# EasyEDA Pro project can-mcu.eprj, board main-board
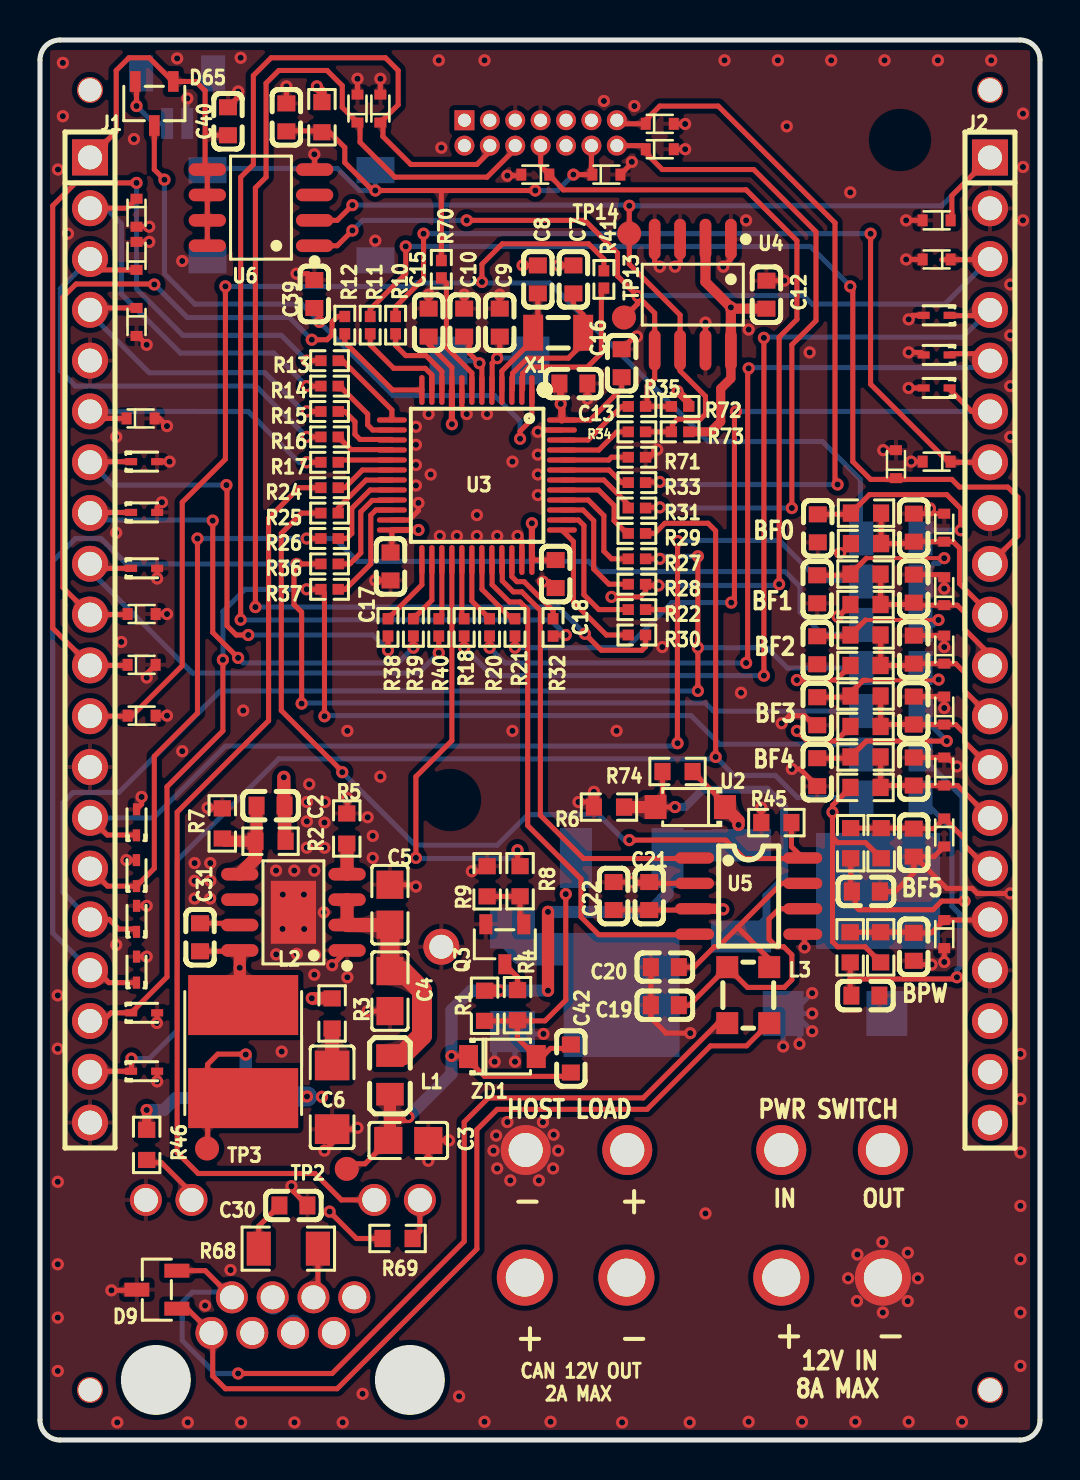
[diagram p7: board, top side]
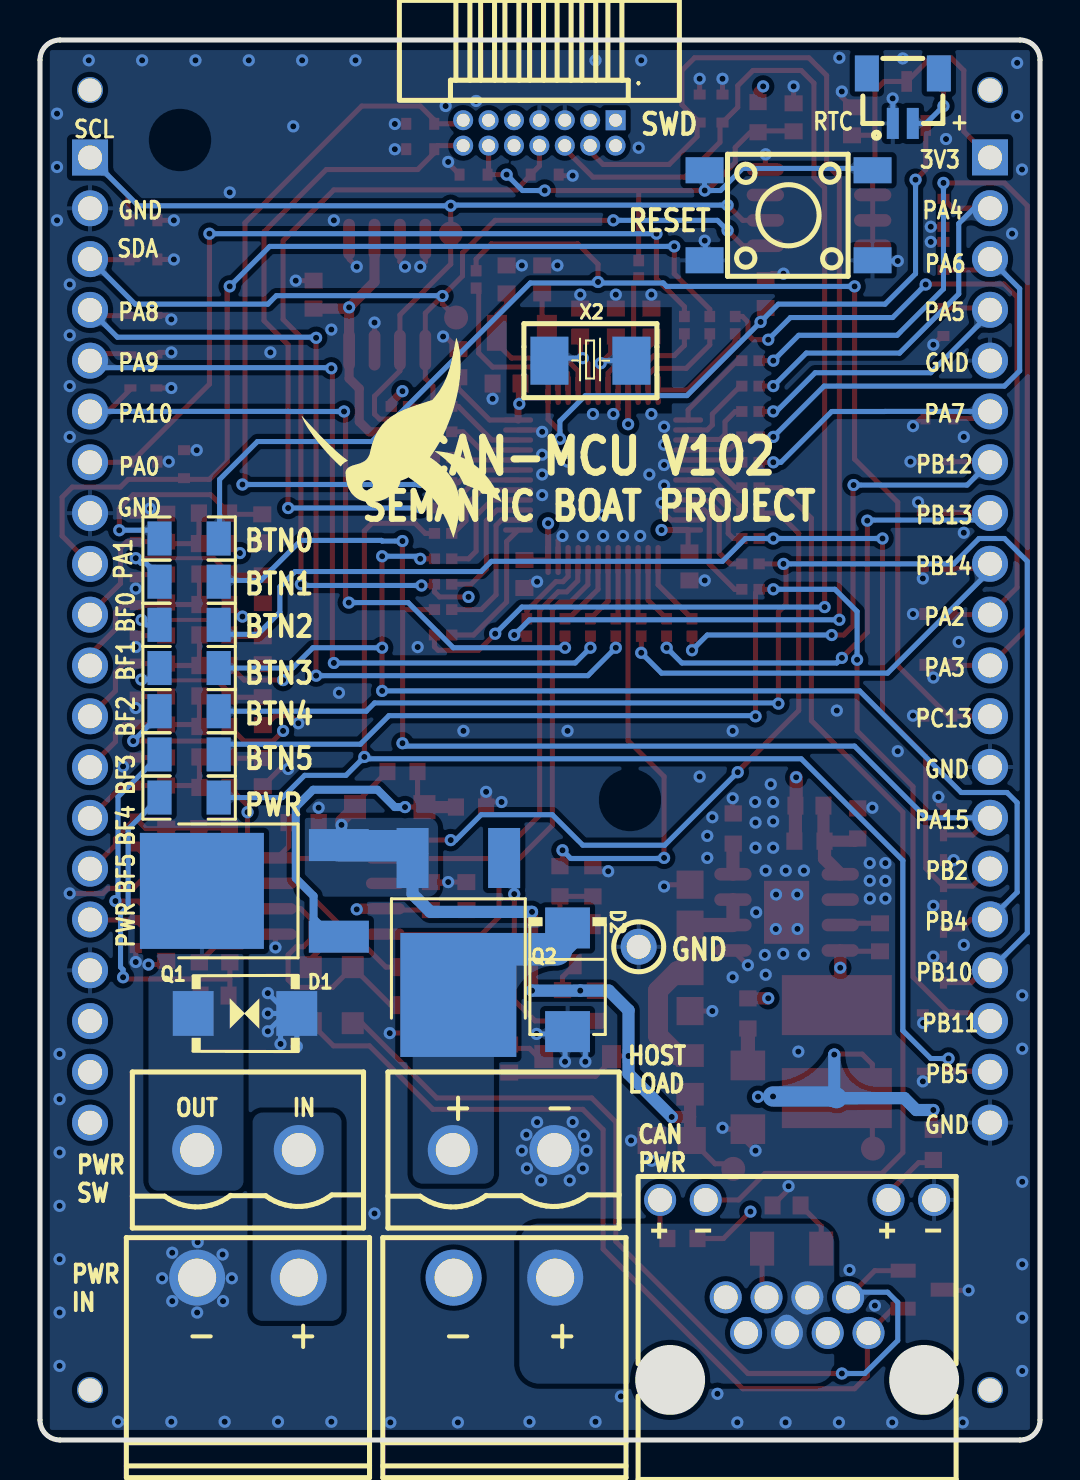
[diagram p8: board, bottom side, seen from below]

Outline 50 x 70 mm; copper layers: Top Layer, Inner1, Inner2, Bottom Layer. Coordinates in mm from the lower left corner of the outline.
Outline path: 0,69 0,1 arc(0.29,0.29) 1,0 49,0 arc(49.71,0.29) 50,1 50,69 arc(49.71,69.71) 49,70 1,70 arc(0.29,69.71) 0,69
Stack: Top Layer 0.035mm Outer layer thickness 1oz / Dielectric1 0.2104mm 7628 RC49% 8.6mil / Inner1 0.0152mm Inner layer thickness / Dielectric2 1.065mm 1.1mm H/HOZ Copper / Inner2 0.0152mm Inner layer thickness / Dielectric3 0.2104mm 7628 RC49% 8.6mil / Bottom Layer 0.035mm Outer layer thickness 1oz

## Design rules (mm)
template: JLCPCB Capability(Two Layers Board)
spacing copperThickness1oz (default): track to track 0.102, other pairs 0.152 to 0.3
spacing copperThickness2oz: track to track 0.203, other pairs 0.152 to 0.3
track width copperThickness1oz (default): min 0.127, default 0.254, max 2.54
track width copperThickness2oz: min 0.203, default 0.254, max 2.54
differential pair differentialPair (default): width min 0.127, default 0.254, max 2.54; gap min 0.152, default 0.152
via viaSize (default): diameter min 0.5, default 0.61, max 10; hole min 0.3, default 0.305, max 6.3

## Placement (name value [footprint] x y rotation side)
C2  100nF  [C0603]  11.53 31.72 0 top
C3  10uF  [C0805]  18.41 14.98 180 top
C4  2.2uF  [C0805]  17.5 22.45 90 top
C5  2.2uF  [C0805]  17.5 26.76 270 top
C6  47uF  [C1206]  14.6 17.14 90 top
C7  22pF  [C0603]  26.67 58.03 270 top
C8  22pF  [C0603]  24.89 58.03 270 top
C9  33pF  [C0603]  22.99 55.87 270 top
C10  33pF  [C0603]  21.21 55.87 270 top
C11  100nF  [C0603]  12.32 66.13 270 top
C12  100nF  [C0603]  36.32 57.27 270 top
C13  4.7uF  [C0603]  26.67 52.82 0 top
C15  100nF  [C0603]  19.43 55.87 90 top
C16  100nF  [C0603]  29.08 53.84 270 top
C17  100nF  [C0603]  17.53 43.68 270 top
C18  100nF  [C0603]  25.78 43.3 270 top
C19  47pF  [C0603]  31.24 21.74 180 top
C20  47pF  [C0603]  31.24 23.64 180 top
C21  4.7uF  [C0603]  30.46 27.2 90 top
C22  100nF  [C0603]  28.68 27.2 90 top
C23  100nF  [C0603]  38.89 45.58 90 top
C24  100nF  [C0603]  38.86 42.53 90 top
C25  100nF  [C0603]  38.86 39.49 90 top
C26  100nF  [C0603]  38.86 36.44 90 top
C27  100nF  [C0603]  38.86 33.39 90 top
C28  100nF  [C0603]  41.3 27.43 180 top
C29  100nF  [C0603]  41.27 22.22 180 top
C30  100nF  [C0603]  12.67 11.73 180 top
C31  2.2nF  [C0603]  8 25.14 270 top
C32  100nF  [C0603]  43.69 45.62 270 top
C33  100nF  [C0603]  43.69 42.57 270 top
C34  100nF  [C0603]  43.69 39.52 270 top
C35  100nF  [C0603]  43.69 36.47 270 top
C36  100nF  [C0603]  43.69 33.42 270 top
C37  100nF  [C0603]  43.69 29.87 90 top
C38  100nF  [C0603]  43.69 24.66 90 top
C39  100nF  [C0603]  13.72 57.3 90 top
C40  100nF  [C0603]  9.4 65.94 270 top
C42  1uF  [C0603]  26.54 19.07 270 top
CN1  DB2EVC-5.08-2P-GN  [CONN-TH_2P-P5.08_DB2EVC-5.08-2P]  39.6 14.5 0 bottom
CN2  DB2ERC-5.08-2P-GN  [CONN-TH_2P-P5.08_DB2ERC-5.08-2P]  39.6 8.12 180 bottom
CN3  DB2EVC-5.08-2P-GN  [CONN-TH_2P-P5.08_DB2EVC-5.08-2P]  26.82 14.5 0 bottom
CN5  DB2ERC-5.08-2P-GN  [CONN-TH_2P-P5.08_DB2ERC-5.08-2P]  26.78 8.12 180 bottom
CN6  BM02B-SRSS-TB(LF)(SN)  [CONN-TH_BM02B-SRSS-TB-LF-SN]  6.86 67.08 0 bottom
CN7  HX PZ1.27-2x7P WZ  [HDR-TH_14P-P1.27-H-M-R2-C7-S1.27-W7.5-N]  25.03 65.35 0 bottom
D1  SMBJ20CA  [SMB_L4.3-W3.6-LS5.4-BI]  39.75 21.33 180 bottom
D2  SS510B  [SMB_L4.6-W3.5-LS5.3-RD]  23.62 23.01 270 bottom
D3  ESD5Z3.3T1G  [SOD-523_L1.2-W0.8-LS1.6-FD]  30.99 65.81 180 top
D4  ESD5Z3.3T1G  [SOD-523_L1.2-W0.8-LS1.6-FD]  17.02 66.57 270 top
D5  ESD5Z3.3T1G  [SOD-523_L1.2-W0.8-LS1.6-FD]  15.88 66.57 270 top
D6  ESD5Z3.3T1G  [SOD-523_L1.2-W0.8-LS1.6-FD]  24.76 63.27 0 top
D7  ESD5Z3.3T1G  [SOD-523_L1.2-W0.8-LS1.6-FD]  28.32 63.27 180 top
D8  ESD5Z3.3T1G  [SOD-523_L1.2-W0.8-LS1.6-FD]  30.99 64.54 180 top
D9  PESD2CAN  [SOT-23-3_L2.9-W1.3-P1.90-LS2.4-BR#2]  5.84 7.52 0 top
D10  ESD5Z3.3T1G  [SOD-523_L1.2-W0.8-LS1.6-FD]  44.83 48.92 0 top
D11  ESD5Z3.3T1G  [SOD-523_L1.2-W0.8-LS1.6-FD]  42.8 48.79 270 top
D12  ESD5Z3.3T1G  [SOD-523_L1.2-W0.8-LS1.6-FD]  5.08 38.76 180 top
D13  ESD5Z3.3T1G  [SOD-523_L1.2-W0.8-LS1.6-FD]  5.08 41.3 180 top
D14  ESD5Z3.3T1G  [SOD-523_L1.2-W0.8-LS1.6-FD]  4.83 61.36 90 top
D15  ESD5Z3.3T1G  [SOD-523_L1.2-W0.8-LS1.6-FD]  4.83 59.2 270 top
D16  ESD5Z3.3T1G  [SOD-523_L1.2-W0.8-LS1.6-FD]  5.03 51.08 180 top
D17  ESD5Z3.3T1G  [SOD-523_L1.2-W0.8-LS1.6-FD]  4.83 55.9 90 top
D18  ESD5Z3.3T1G  [SOD-523_L1.2-W0.8-LS1.6-FD]  5.08 36.22 180 top
D19  ESD5Z3.3T1G  [SOD-523_L1.2-W0.8-LS1.6-FD]  44.83 60.98 0 top
D20  ESD5Z3.3T1G  [SOD-523_L1.2-W0.8-LS1.6-FD]  44.83 59.03 0 top
D21  PESD5V0X1UB(UMW)  [SOD-523_L1.2-W0.8-LS1.6-RD]  44.83 56.23 180 top
D22  PESD5V0X1UB(UMW)  [SOD-523_L1.2-W0.8-LS1.6-RD]  44.83 54.25 180 top
D23  PESD5V0X1UB(UMW)  [SOD-523_L1.2-W0.8-LS1.6-RD]  44.83 52.6 180 top
D24  PESD5V0X1UB(UMW)  [SOD-523_L1.2-W0.8-LS1.6-RD]  4.83 30.88 90 top
D25  PESD5V0X1UB(UMW)  [SOD-523_L1.2-W0.8-LS1.6-RD]  4.83 28.34 90 top
D26  PESD5V0X1UB(UMW)  [SOD-523_L1.2-W0.8-LS1.6-RD]  4.83 26.06 90 top
D27  PESD5V0X1UB(UMW)  [SOD-523_L1.2-W0.8-LS1.6-RD]  5.21 18.44 0 top
D28  PESD5V0X1UB(UMW)  [SOD-523_L1.2-W0.8-LS1.6-RD]  4.83 23.52 90 top
D29  PESD5V0X1UB(UMW)  [SOD-523_L1.2-W0.8-LS1.6-RD]  5.21 21.36 0 top
D30  PESD5V0X1UB(UMW)  [SOD-523_L1.2-W0.8-LS1.6-RD]  5.21 48.92 0 top
D31  PESD5V0X1UB(UMW)  [SOD-523_L1.2-W0.8-LS1.6-RD]  5.21 43.58 0 top
D32  PESD5V0X1UB(UMW)  [SOD-523_L1.2-W0.8-LS1.6-RD]  5.21 46.38 0 top
D58  ESD5Z3.3T1G  [SOD-523_L1.2-W0.8-LS1.6-FD]  45.21 45.62 270 top
D59  ESD5Z3.3T1G  [SOD-523_L1.2-W0.8-LS1.6-FD]  45.21 42.44 270 top
D60  ESD5Z3.3T1G  [SOD-523_L1.2-W0.8-LS1.6-FD]  45.21 39.52 270 top
D61  ESD5Z3.3T1G  [SOD-523_L1.2-W0.8-LS1.6-FD]  45.21 36.47 270 top
D62  ESD5Z3.3T1G  [SOD-523_L1.2-W0.8-LS1.6-FD]  45.21 33.42 270 top
D63  ESD5Z3.3T1G  [SOD-523_L1.2-W0.8-LS1.6-FD]  45.21 30.38 90 top
D64  ESD5Z3.3T1G  [SOD-523_L1.2-W0.8-LS1.6-FD]  45.21 25.3 90 top
D65  BAV70  [SOT-23-3_L3.0-W1.7-P0.95-LS2.9-BR]  5.72 66.83 90 top
J1  2.54-1*20P直针  [HDR-TH_20P-P2.54-V-M-1]  2.5 40 270 top
J2  2.54-1*20P直针  [HDR-TH_20P-P2.54-V-M-1]  47.5 40 270 top
L1  BLM21PG331SN1D  [L0805]  17.5 18.26 90 top
L2  68uH  [IND-SMD_L5.8-W5.2]  10.16 19.42 90 top
L3  WCM3225F2SF-601T10  [FILTER-SMD_4P-L3.2-W2.5-TL_ACM3225]  35.41 22.24 270 top
NOREF  -  [Pad_e11775]  2.5 67.5 270 top
NOREF#2  -  [Pad_e13967]  2.5 2.5 270 top
NOREF#3  -  [Pad_e11774]  47.5 67.5 270 top
NOREF#4  -  [Pad_e11773]  47.5 2.5 270 top
Q1  AGM60P90D  [TO-252-2_L6.6-W6.1-P4.57-LS9.9-BR-CW]  38.48 27.45 180 bottom
Q2  AGM60P90D  [TO-252-2_L6.6-W6.1-P4.57-LS9.9-BR-CW]  29.08 25.68 90 bottom
Q3  MMBT5551(RANGE:200-300)  [SOT-23-3_L2.9-W1.3-P1.90-LS2.4-BR]  23.24 24.79 90 top
R1  10kΩ  [R0603]  22.23 21.71 90 top
R2  21kΩ  [R0603]  11.53 29.94 0 top
R3  330mΩ  [R0603]  14.6 21.33 90 top
R4  1kΩ  [R0603]  23.88 21.74 270 top
R5  100kΩ  [R0603]  15.34 30.57 270 top
R6  47kΩ  [R0603]  28.45 31.65 0 top
R7  12kΩ  [R0603]  9.11 30.83 270 top
R8  4.7kΩ  [R0603]  24 27.94 270 top
R9  10kΩ  [R0603]  22.36 27.93 270 top
R10  100Ω  [R0402]  17.78 55.74 270 top
R11  100Ω  [R0402]  16.51 55.74 270 top
R12  100Ω  [R0402]  15.24 55.74 270 top
R13  100Ω  [R0402]  14.48 53.97 0 top
R14  33Ω  [R0402]  14.48 52.69 180 top
R15  33Ω  [R0402]  14.48 51.42 180 top
R16  33Ω  [R0402]  14.48 50.16 180 top
R17  33Ω  [R0402]  14.48 48.89 180 top
R18  100Ω  [R0402]  21.21 40.63 90 top
R20  100Ω  [R0402]  22.48 40.63 90 top
R21  100Ω  [R0402]  23.75 40.63 90 top
R22  100Ω  [R0402]  29.84 41.52 180 top
R24  100Ω  [R0402]  14.48 47.61 0 top
R25  100Ω  [R0402]  14.48 46.34 0 top
R26  100Ω  [R0402]  14.48 45.08 0 top
R27  100Ω  [R0402]  29.84 44.06 180 top
R28  33Ω  [R0402]  29.84 42.79 180 top
R29  100Ω  [R0402]  29.84 45.33 180 top
R30  33Ω  [R0402]  29.84 40.25 180 top
R31  33Ω  [R0402]  29.84 46.6 0 top
R32  33Ω  [R0402]  25.65 40.63 90 top
R33  33Ω  [R0402]  29.84 47.87 0 top
R34  33Ω  [R0402]  29.84 50.41 0 top
R35  33Ω  [R0402]  29.84 51.68 0 top
R36  100Ω  [R0402]  14.48 43.81 0 top
R37  100Ω  [R0402]  14.48 42.53 0 top
R38  100Ω  [R0402]  17.4 40.63 90 top
R39  100Ω  [R0402]  18.67 40.63 90 top
R40  100Ω  [R0402]  19.94 40.63 90 top
R41  100Ω  [R0402]  28.19 58.03 270 top
R42  10kΩ  [R0603]  14.1 66.14 90 top
R45  33kΩ  [R0603]  36.82 30.87 0 top
R46  1kΩ  [R0603]  5.33 14.75 90 top
R47  0Ω  [R1206]  42.54 45.08 180 bottom
R48  0Ω  [R1206]  42.54 42.92 180 bottom
R49  0Ω  [R1206]  42.54 40.76 180 bottom
R50  0Ω  [R1206]  42.54 38.6 180 bottom
R51  0Ω  [R1206]  42.54 36.44 180 bottom
R52  0Ω  [R1206]  42.54 34.28 180 bottom
R53  0Ω  [R1206]  42.54 32.12 180 bottom
R54  10kΩ  [R0603]  41.3 44.82 180 top
R55  10kΩ  [R0603]  41.28 41.77 180 top
R56  10kΩ  [R0603]  41.28 38.72 180 top
R57  10kΩ  [R0603]  41.28 35.68 180 top
R58  10kΩ  [R0603]  41.28 32.63 180 top
R59  10kΩ  [R0603]  42.06 29.84 270 top
R60  10kΩ  [R0603]  42.03 24.63 270 top
R61  1kΩ  [R0603]  41.3 46.34 180 top
R62  1kΩ  [R0603]  41.28 43.3 180 top
R63  1kΩ  [R0603]  41.28 40.25 180 top
R64  1kΩ  [R0603]  41.28 37.2 180 top
R65  1kΩ  [R0603]  41.28 34.15 180 top
R66  1kΩ  [R0603]  40.53 29.84 270 top
R67  1kΩ  [R0603]  40.51 24.63 270 top
R68  100Ω  [R1206]  12.42 9.57 0 top
R69  1kΩ  [R0603]  17.88 10.07 180 top
R70  220Ω  [R0402]  20.07 58.54 270 top
R71  47kΩ  [R0402]  29.84 49.14 180 top
R72  2.2kΩ  [R0402]  32 51.68 0 top
R73  2.2kΩ  [R0402]  32 50.41 0 top
R74  100kΩ  [R0603]  31.88 33.42 0 top
RJ1  HC-RJ45-5JA-1-5  [RJ45-TH_HC-RJ45-5JA-1-5]  12.14 8.68 180 bottom
SW1  TS-1002S-05026C  [KEY-SMD_4P-L6.0-W6.0-P4.50-LS9.0]  12.57 61.24 180 bottom
TP1  RH-5004  [TESTPOINT_TH_BD2.5-D1.2]  20.07 24.66 0 bottom
TP2  -  [Test-Point-0.5mm]  15.34 13.56 270 top
TP3  -  [Test-Point-0.5mm]  8.35 14.57 0 top
TP13  -  [Test-Point-0.5mm]  29.2 56.12 0 top
TP14  -  [Test-Point-0.5mm]  29.46 60.33 90 top
U1  EA8951T8R  [ESOP-8_L4.9-W3.9-P1.27-LS6.0-BL-EP-2]  12.67 26.38 90 top
U2  BZT52C15  [SOD-123_L2.7-W1.6-LS3.8-RD]  32.51 31.65 180 top
U3  STM32L431CCT6  [LQFP-48_L7.0-W7.0-P0.50-LS9.0-BL]  21.84 48.25 180 top
U4  AT24C256C-SSHL-T  [SOIC-8_L4.9-W3.9-P1.27-LS6.0-BL]  32.64 57.27 180 top
U5  SN65HVD233DR  [SOIC-8_L5.0-W4.0-P1.27-LS6.0-BL]  35.43 27.2 270 top
U6  TMP75AIDR(UMW)  [SOP-8_L4.9-W3.9-P1.27-LS6.0-BL]  11.05 61.62 90 top
X1  32.768kHz  [FC-135R_L3.2-W1.5]  25.91 55.36 0 top
X2  8MHz  [CRYSTAL-SMD_L5.0-W3.2]  22.48 53.97 0 bottom
ZD1  MMSZ5245B  [SOD-123_L2.8-W1.8-LS3.7-RD]  23.12 19.17 0 top

## Footprints (pads in the part's own frame, mm; a bottom-side part is the same pattern mirrored in y, then rotated)
C0603
  rect 0.8x0.9 smd: 1(-0.7,0) 2(0.7,0)
C0805
  rect 1.41x1.35 smd: 1(-1,0) 2(1,0)
C1206
  rect 1.485x1.728 smd: 1(-1.593,0) 2(1.593,0)
CONN-TH_2P-P5.08_DB2ERC-5.08-2P
  round 2.8 hole 1.9: 1(-2.54,0) 2(2.54,0)
CONN-TH_2P-P5.08_DB2EVC-5.08-2P
  round 2.5 hole 1.7: 1(-2.54,0) 2(2.54,0)
CONN-TH_BM02B-SRSS-TB-LF-SN
  rect 0.6x1.55 smd: 1(0.502,1.25) 2(-0.498,1.25)
  rect 1.2x1.8 smd: 3(1.8,-1.25) 4(-1.8,-1.25)
CRYSTAL-SMD_L5.0-W3.2
  rect 1.9x2.4 smd: 1(-2.05,0) 2(2.05,0)
ESOP-8_L4.9-W3.9-P1.27-LS6.0-BL-EP-2
  oval 0.63x1.865 smd: 1(-1.905,-2.683) 2(-0.635,-2.683) 3(0.635,-2.683) 4(1.905,-2.683) 5(1.905,2.683) 6(0.635,2.683) 7(-0.635,2.683) 8(-1.905,2.683)
  rect 3.15x2.26 smd: 9(0,0)
FC-135R_L3.2-W1.5
  rect 1x1.8 smd: 1(-1.25,0) 2(1.25,0)
FILTER-SMD_4P-L3.2-W2.5-TL_ACM3225
  rect 1.1x1.1 smd: 1(-1.4,1.05) 2(-1.4,-1.05) 3(1.4,-1.05) 4(1.4,1.05)
HDR-TH_14P-P1.27-H-M-R2-C7-S1.27-W7.5-N
  rect 1x1 hole 0.65: 1(-3.81,-0.635)
  round 1 hole 0.65: 2(-3.81,0.635) 3(-2.54,-0.635) 4(-2.54,0.635) 5(-1.27,-0.635) 6(-1.27,0.635) 7(0,-0.635) 8(0,0.635) 9(1.27,-0.635) 10(1.27,0.635) 11(2.54,-0.635) 12(2.54,0.635) 13(3.81,-0.635) 14(3.81,0.635)
HDR-TH_20P-P2.54-V-M-1
  rect 1.8x1.8 hole 1.2: 1(-24.13,0)
  round 1.8 hole 1.2: 2(-21.59,0) 3(-19.05,0) 4(-16.51,0) 5(-13.97,0) 6(-11.43,0) 7(-8.89,0) 8(-6.35,0) 9(-3.81,0) 10(-1.27,0) 11(1.27,0) 12(3.81,0) 13(6.35,0) 14(8.89,0) 15(11.43,0) 16(13.97,0) 17(16.51,0) 18(19.05,0) 19(21.59,0) 20(24.13,0)
IND-SMD_L5.8-W5.2
  rect 3x5.5 smd: 1(2.325,0) 2(-2.325,0)
KEY-SMD_4P-L6.0-W6.0-P4.50-LS9.0
  rect 1.9x1.3 smd: 1(-4.2,2.25) 2(4.2,2.25) 3(-4.2,-2.25) 4(4.2,-2.25)
L0805
  rect 1.133x1.377 smd: 1(-0.966,0) 2(0.966,0)
LQFP-48_L7.0-W7.0-P0.50-LS9.0-BL
  oval 0.27x1.5 smd: 1(-2.75,-4.25) 2(-2.25,-4.25) 3(-1.75,-4.25) 4(-1.25,-4.25) 5(-0.75,-4.25) 6(-0.25,-4.25) 7(0.25,-4.25) 8(0.75,-4.25) 9(1.25,-4.25) 10(1.75,-4.25) 11(2.25,-4.25) 12(2.75,-4.25) 25(2.75,4.25) 26(2.25,4.25) 27(1.75,4.25) 28(1.25,4.25) 29(0.75,4.25) 30(0.25,4.25) 31(-0.25,4.25) 32(-0.75,4.25) 33(-1.25,4.25) 34(-1.75,4.25) 35(-2.25,4.25) 36(-2.75,4.25)
  oval 1.5x0.27 smd: 13(4.25,-2.75) 14(4.25,-2.25) 15(4.25,-1.75) 16(4.25,-1.25) 17(4.25,-0.75) 18(4.25,-0.25) 19(4.25,0.25) 20(4.25,0.75) 21(4.25,1.25) 22(4.25,1.75) 23(4.25,2.25) 24(4.25,2.75) 37(-4.25,2.75) 38(-4.25,2.25) 39(-4.25,1.75) 40(-4.25,1.25) 41(-4.25,0.75) 42(-4.25,0.25) 43(-4.25,-0.25) 44(-4.25,-0.75) 45(-4.25,-1.25) 46(-4.25,-1.75) 47(-4.25,-2.25) 48(-4.25,-2.75)
Pad_e11773
  round 1.3 hole 1.152: 1(0,0)
Pad_e11774
  round 1.3 hole 1.152: 1(0,0)
Pad_e11775
  round 1.3 hole 1.152: 1(0,0)
Pad_e13967
  round 1.3 hole 1.152: 1(0,0)
R0402
  rect 0.566x0.54 smd: 1(-0.433,0) 2(0.433,0)
R0603
  rect 0.806x0.864 smd: 1(-0.753,0) 2(0.753,0)
R1206
  rect 1.208x1.701 smd: 1(-1.479,0) 2(1.479,0)
RJ45-TH_HC-RJ45-5JA-1-5
  round 1.6 hole 1.2: 1(3.57,-3.325) 2(2.55,-1.545) 3(1.53,-3.325) 4(0.51,-1.545) 5(-0.51,-3.325) 6(-1.53,-1.545) 7(-2.55,-3.325) 8(-3.57,-1.545) 9(-6.85,3.325) 10(-4.57,3.325) 11(4.57,3.325) 12(6.85,3.325)
SMB_L4.3-W3.6-LS5.4-BI
  rect 2.047x2.241 smd: 1(-2.591,0) 2(2.591,0)
SMB_L4.6-W3.5-LS5.3-RD
  rect 2.047x2.241 smd: 1(-2.591,0) 2(2.591,0)
SOD-123_L2.7-W1.6-LS3.8-RD
  rect 1.1x1.2 smd: 1(-1.735,0) 2(1.735,0)
SOD-123_L2.8-W1.8-LS3.7-RD
  rect 0.95x1.15 smd: 1(-1.692,0) 2(1.692,0)
SOD-523_L1.2-W0.8-LS1.6-FD
  rect 0.5x0.6 smd: 1(-0.7,0) 2(0.7,0)
SOD-523_L1.2-W0.8-LS1.6-RD
  rect 0.6x0.36 smd: 1(-0.65,0) 2(0.65,0)
SOIC-8_L4.9-W3.9-P1.27-LS6.0-BL
  oval 0.588x2.045 smd: 1(-1.905,-2.772) 2(-0.635,-2.772) 3(0.635,-2.772) 4(1.905,-2.772) 5(1.905,2.772) 6(0.635,2.772) 7(-0.635,2.772) 8(-1.905,2.772)
SOIC-8_L5.0-W4.0-P1.27-LS6.0-BL
  oval 0.569x1.95 smd: 1(-1.905,-2.705) 2(-0.635,-2.705) 3(0.635,-2.705) 4(1.905,-2.705) 5(1.905,2.705) 6(0.635,2.705) 7(-0.635,2.705) 8(-1.905,2.705)
SOP-8_L4.9-W3.9-P1.27-LS6.0-BL
  oval 0.63x1.865 smd: 1(-1.905,-2.683) 2(-0.635,-2.683) 3(0.635,-2.683) 4(1.905,-2.683) 5(1.905,2.683) 6(0.635,2.683) 7(-0.635,2.683) 8(-1.905,2.683)
SOT-23-3_L2.9-W1.3-P1.90-LS2.4-BR
  rect 1x0.65 smd: 1(1,-0.95) 2(1,0.95) 3(-1,0)
SOT-23-3_L2.9-W1.3-P1.90-LS2.4-BR#2
  rect 1.25x0.7 smd: 1(1,-0.95) 2(1,0.95) 3(-1,0)
SOT-23-3_L3.0-W1.7-P0.95-LS2.9-BR
  rect 1.038x0.532 smd: 1(1.101,-0.95) 2(1.101,0.95) 3(-1.101,0)
Test-Point-0.5mm
  round 1.2 smd: 1(0,0)
TESTPOINT_TH_BD2.5-D1.2
  round 1.8 hole 1.2: 1(0,0)
TO-252-2_L6.6-W6.1-P4.57-LS9.9-BR-CW
  rect 3x1.6 smd: 1(3.424,-2.29) 3(3.424,2.29)
  rect 6.2x5.8 smd: 2(-3.424,0)

## Nets
As in the schematic.

Pads without a net: CN6 3 4; CN7 1 2 9 10 11; J2 18 19; NOREF 1; NOREF#2 1; NOREF#3 1; NOREF#4 1; U1 6; U6 3

## Via types
v1: diameter 0.61, hole 0.305, Top Layer to Bottom Layer, 340 vias

## Routing (per net, layer and track width the routed paths; a pad name or vN(x,y) marks a point on that pad's centre or on a via; arc(x,y) is an arc through that point)
+3V3: length 314.1
  Top Layer w0.254: 25.91,44 25.91,44 U3.36 ; U3.48 27.51,51 29.08,52.57 C16.2 ; C22.1 C21.1 32.64,26.5 32.71,26.56 ; U3.9 20.59,53.63 19.43,54.79 C15.1 ; v1(40,44.35) 40.07,44.35 R54.2 ; R57.2 39.79,34.95 38.35,34.95 v1(37.85,35.46) ; 8.25,65.25 8.27,65.24 C40.2 ; 8.25,65.25 8.25,63.63 U6.5 U6.6 U6.8 ; 8.25,65.25 8.25,67.46 7.79,67.93 D65.1 6.65,67.93 5.46,69.11 4.44,69.11 3.81,68.48 3.81,65.43 2.51,64.13 J1.1 ; v1(14.48,11.42) 15.82,10.07 R69.2 ; R60.2 41.25,24.66 39.88,24.66 39.62,24.92 39.62,30.12 ; R59.2 41.28,29.87 39.88,29.87 39.62,30.12 ; v1(39.88,41.17) 39.92,41.17 R55.2 ; R58.2 39.62,31.73 v1(39.62,31.39) 39.62,30.12 ; C17.1 17.59,44.45 U3.24 ; v1(10.29,19.27) 10.26,19.29 8.89,19.29 8.38,18.79 8.38,14.6 TP3.1 ; v1(37.85,38) 39.79,38 R56.2
  Top Layer w0.305: U3.9 v1(20.59,50.79) ; U3.36 v1(24.59,45.84) ; U3.24 v1(18.92,45.5)
  Top Layer w0.355: C13.1 26.03,52.76 v1(26.03,51.81) 26.09,51.75 U3.48
  Top Layer w0.406: R72.2 32.44,51.88 v1(31.88,52.44)
  Top Layer w0.457: R46.2 v1(5.33,16.5) ; R73.2 33.53,50.41 34.04,50.92 34.04,52.57 34.54,53.08 U4.8 ; R42.2 14.1,67.43 v1(13.84,67.68)
  Top Layer w0.508: U4.2 33.27,57.9 v1(34.54,56.63) ; 32.71,26.56 34.13,26.56 v1(34.16,26.53) ; C12.2 34.61,56.57 v1(34.54,56.63) ; U4.8 v1(34.54,56.63)
  Top Layer w0.559: 13.72,22.09 13.65,22.02
  Top Layer w0.61: 13.72,22.09 14.6,22.09 R3.2
  Top Layer w0.66: R2.2 12.23,29.99 C2.2 12.19,31.75 v1(12.19,33.14)
  Inner1 w0.254: 38.74,41.17 38.74,41.17 v1(39.88,41.17) ; v1(13.84,67.68) 14.22,67.3 19.18,67.3 19.94,68.06 21.97,68.06 22.46,67.57 ; v1(14.48,11.42) 14.73,11.67 14.73,14.15 14.81,14.23 14.81,14.71 14.1,15.42 v1(14.1,17.16) ; v1(37.85,38) 38.73,38 38.74,37.99 ; 38.74,35.6 38.59,35.46 v1(37.85,35.46) ; v1(39.62,31.39) 38.74,31.39 ; v1(40,44.35) 38.99,44.35
  Inner1 w0.35: v1(12.19,33.14) 8.25,33.14 6.98,31.87 6.98,22.57 v1(10.29,19.27)
  Inner1 w0.406: CN7.3 22.49,67.54 22.46,67.57
  Inner1 w0.508: v1(31.88,52.44) 34.54,55.11 v1(34.54,56.63)
  Inner1 w0.559: v1(13.59,22.09) 12.16,22.09 10.29,20.22 v1(10.29,19.27)
  Inner1 w0.762: v1(26.03,51.81) 24.38,51.81 22.4,49.82 22.4,48.86 ; 22.4,48.86 22.32,48.94 20.59,48.94 ; 22.4,48.86 22.4,48.03 v1(24.59,45.84) ; 20.59,48.94 v1(20.59,50.79) 20.59,50.86 20.5,50.95 20.5,51.12 20.45,51.17 20.45,52.06 8.38,64.12 2.5,64.12 J1.1 ; 20.59,48.94 20.59,47.13 18.97,45.5 v1(18.92,45.5) 18.99,45.44 18.99,42.6 16.26,39.87 16.26,36.44 17.91,34.79 17.91,19.83
  Inner1 w0.9: 37.89,60.23 37.89,61.95 31.37,68.47 23.36,68.47 22.46,67.57
  Inner1 w1.016: 41.66,58.16 39.58,60.23 37.89,60.23 34.54,56.89 v1(34.54,56.63) ; 41.66,58.16 41.6,58.11 41.6,55.86 38.74,52.99 38.74,31.11 v1(34.16,26.53) 31.78,24.15 22.22,24.15 15.23,17.16 v1(14.1,17.16) 13.36,17.16 v1(13.35,17.18) ; 41.66,58.16 41.66,58.57
  Bottom Layer w0.61: L2.2 6.79,17.1 6.19,16.5 v1(5.33,16.5) ; v1(10.29,19.27) 10.29,17.14
  Bottom Layer w1.016: L2.2 10.2,17.14 10.29,17.14 10.33,17.18 v1(13.35,17.18)
+12V: length 75.6
  Top Layer w0.254: U2.1 34.25,31.81 R74.2 ; C42.2 26.35,18.18 22.22,18.18 21.21,19.2 v1(20.57,19.2) ; 15.34,13.81 16.25,13.81 C3.2 ; 22.23,22.47 R1.2
  Top Layer w0.61: v1(18.41,16.15) 17.5,16.15 17.5,16.16 ; 17.5,16.16 L1.1 ; 17.5,16.16 17.5,15.06 ; v1(25.4,26.41) v1(25.4,22.47) ; v1(34.93,30.76) 34.93,30.97 U2.1 ; v1(22.99,22.47) 22.23,22.47
  Top Layer w1.169: C3.2 17.5,15.06
  Inner1 w0.762: v1(18.41,16.15) 18.41,16.18 19.66,17.42 44.2,17.42 45.75,15.86 47.5,15.86
  Bottom Layer w0.559: v1(34.93,30.76) 34.93,29.84 35.06,29.71
  Bottom Layer w0.61: v1(25.4,26.41) 30.48,26.41 31.37,27.3 31.37,29.31 ; v1(25.4,22.47) v1(22.99,22.47) 21.56,22.47 20.57,21.49 v1(20.57,19.2) 20.57,18.31 v1(18.41,16.15)
  Bottom Layer w1.575: 31.37,29.31 31.77,29.71 35.06,29.71
GND: length 111.4
  Top Layer w0.254: C13.2 v1(27.37,52.06) ; v1(36.07,31.61) 36.07,30.87 R45.1 ; D11.1 v1(42.16,49.49) ; 44,60.98 v1(43.31,60.98) ; C9.1 v1(22.99,57.27) ; C20.2 C19.2 30.54,21.11 31.3,20.34 v1(32.51,20.34) ; D63.1 44.7,29.17 43.75,29.17 ; v1(18.92,46.85) 18.92,46.47 18.45,46 U3.23 ; D3.1 32.25,65.81 v1(32.26,65.8) ; 43.75,29.17 45.34,27.58 46.61,27.58 46.86,27.33 v1(48.51,27.33) ; 43.75,29.17 C37.1 43.69,28.34 42.77,27.43 C28.1 ; v1(23.88,45.2) 24.09,44.98 U3.35 ; C15.2 v1(19.43,57.27) ; v1(45.21,36.6) D61.1 C35.1 ; v1(43.43,56.03) 43.64,56.23 D21.2 ; v1(21.34,51.3) 21.09,51.54 U3.8 ; U5.5 38.23,25.2 v1(38.23,24.63) ; D32.2 5.86,46.65 v1(6.1,46.89) ; D31.2 5.86,42.95 ; v1(5.33,38.12) 5.33,38.31 D12.1 ; v1(5.08,32.15) 5.08,31.79 D24.2 ; D25.2 v1(4.32,28.99) ; U3.47 24.98,50.5 v1(24.89,50.41) ; v1(14.22,14.47) 14.6,14.85 C6.1 15.81,15.54 v1(15.88,15.61) ; R7.1 9.08,31.61 v1(8.38,31.61) ; v1(29.84,55.17) 29.72,55.17 C16.1 ; 44,48.92 v1(43.56,48.92) ; C22.2 v1(29.59,27.9) ; v1(29.59,27.9) 29.66,27.83 U5.2 ; v1(29.59,27.9) C21.2 ; D26.2 v1(5.33,26.71) ; v1(44.58,23.77) 43.88,23.77 C38.1 ; R71.1 30.48,49.14 v1(30.86,49.52) ; D17.1 4.89,55.2 v1(5.33,54.76) ; v1(23.37,63.22) 24.01,63.22 D6.1 ; v1(37.59,33.55) 38,33.55 C27.1 ; v1(45.21,39.65) D60.1 C34.1 ; v1(45.85,33.68) 45.4,34.12 D62.1 C36.1 ; U4.3 32,58.92 v1(31.75,58.66) ; C39.2 13.4,58.32 v1(12.83,58.32) ; 38.86,35.74 38.71,35.74 38.23,36.22 37.47,36.22 v1(37.08,35.84) ; D5.1 v1(15.88,68.06) ; D18.1 v1(6.35,36.22) ; D22.2 44.05,54.38 v1(43.43,54.38) ; U4.4 30.73,58.92 v1(30.99,58.66) ; D8.1 v1(32.26,64.54) ; C33.1 45.09,43.27 D59.1 v1(45.21,42.57) ; v1(29.59,63.9) 29.59,63.84 D7.1 ; v1(25.15,42.92) 25.46,42.92 C18.2 ; D9.3 4.81,7.48 v1(3.57,7.48) ; C32.1 44.58,46.32 44.5,46.39 v1(44.5,46.57) 44.75,46.32 D58.1 ; D23.2 v1(43.43,52.6) ; v1(6.35,50.7) 5.97,51.08 D16.1 ; D13.1 v1(6.35,41.3) ; D4.1 v1(17.02,68.06) ; D28.2 v1(5.33,24.17) ; 44,59.03 v1(43.31,59.03) ; R5.1 15.37,31.36 v1(15.37,32.09) ; v1(5.84,20.85) 5.86,20.87 D29.2 ; C8.1 v1(24.13,58.73) ; C17.2 v1(16.76,42.98) ; v1(19.41,13.96) C3.1 v1(20.45,14.98) ; 13.37,11.73 12.57,12.52 v1(12.57,12.69) ; v1(21.59,28.44) 22.11,28.44 R9.1 ; v1(34.16,58.66) 34.54,59.05 U4.1 ; C5.1 18.71,27.76 v1(18.8,27.68) ; U6.4 13.73,64.27 v1(13.72,64.28) ; D64.1 v1(45.21,23.9) ; U1.1 14.61,23.74 v1(14.6,23.74) ; C40.1 9.91,67.15 v1(9.91,67.42) ; R6.1 27.44,31.9 v1(26.92,31.9) ; C4.1 v1(16.38,21.45) ; D27.2 v1(5.86,17.93) ; C12.1 v1(37.21,57.97) ; C10.1 v1(21.21,57.27) ; D15.1 v1(5.46,59.91) ; U4.7 v1(33.27,55.87) ; D30.2 v1(6.48,48.92) ; D14.1 v1(5.46,60.66) ; 12.32,66.86 v1(12.32,67.68) ; C7.1 v1(25.91,58.73)
  Top Layer w0.559: v1(27.69,32.41) R6.1
  Bottom Layer w0.254: 16.73,59 16.73,59.94 v1(16.76,59.97) ; 23.79,20.3 23.5,20.6 22.73,19.84 v1(22.73,18.91) ; 23.79,20.3 v1(25.17,20.3) ; 23.79,20.3 23.75,20.26 v1(23.75,18.91) ; v1(7.37,67.08) 7.36,67.07 CN6.1 ; D1.2 v1(37.16,19.67) ; D1.2 37.59,21.76 ; D1.2 37.97,20.51 v1(37.97,19.8) ; 37.59,21.33 v1(38.61,22.34) ; v1(7.11,58.95) 8.34,58.95 8.37,58.99 ; v1(38.61,21.33) 37.72,21.33 v1(38.61,20.44)
  vias: v1(0.9,63.52) v1(0.89,22.23) v1(0.89,19.56) v1(0.89,12.91) v1(0.89,8.79) v1(0.89,6.12) v1(0.89,3.45) v1(1.14,68.86) v1(1.14,66.19) v1(1.4,60.31) v1(3.81,50.16) v1(3.81,45.36) v1(3.81,24.75) v1(3.86,0.88) v1(4.06,39.9) v1(4.7,65.05) v1(5.86,43.08) v1(6.86,69.08) v1(7.11,34.44) v1(7.39,0.88) v1(7.73,28.85) v1(7.73,27.96) v1(7.73,27.07) v1(8.25,6.72) v1(8.51,28.85) v1(8.51,27.96) v1(8.51,27.07) v1(9.53,8.5) v1(10.03,69.11) v1(10.06,0.88) v1(10.16,36.47) v1(11.8,28.47) v1(11.81,24.28) v1(12.14,27.27) v1(12.13,25.55) v1(12.08,19.42) v1(12.71,28.47) v1(12.72,0.88) v1(12.84,24.31) v1(13.2,27.27) v1(13.21,25.55) v1(13.34,31.9) v1(13.34,30.93) v1(13.34,29.61) v1(13.46,32.79) v1(13.72,28.47) v1(13.72,23.26) v1(13.76,24.25) v1(14.24,31.9) v1(14.22,30.87) v1(14.22,29.61) v1(14.19,26.38) v1(15.14,0.88) v1(15.37,35.46) v1(15.37,23.14) v1(16.13,2.31) v1(16.38,31.14) v1(16.64,30.21) v1(16.64,29.11) v1(17.02,33.17) v1(18.8,50.66) v1(18.8,49.76) v1(18.8,48.75) v1(18.8,47.73) v1(19.43,51.3) v1(19.53,48.28) v1(19.94,68.98) v1(19.99,45.2) v1(20.07,64.61) v1(20.85,45.2) v1(20.96,2.18) v1(21.84,46.25) v1(21.84,45.2) v1(22.22,68.98) v1(22.22,0.91) v1(22.35,51.3) v1(22.67,14.47) v1(22.81,15.22) v1(22.86,45.2) v1(22.86,13.58) v1(23.37,15.9) v1(23.51,12.98) v1(23.62,48.92) v1(23.62,35.46) v1(24.89,49.27) v1(24.89,48.28) v1(24.89,47.25) v1(24.94,12.98) v1(25.15,15.89) v1(25.53,0.91) v1(25.68,15.26) v1(25.65,13.58) v1(25.91,14.47) v1(28.19,66.95) v1(28.83,35.46) v1(29.11,0.88) v1(29.72,66.7) v1(31.12,39.65) v1(32.48,0.88) v1(33.27,11.33) v1(34.23,68.98) v1(35.05,37.36) v1(35.31,60.98) v1(35.43,55.52) v1(35.43,0.91) v1(36.89,68.98) v1(37.34,65.68) v1(38.1,0.91) v1(38.48,54.38) v1(39.56,68.98) v1(40.41,8.09) v1(40.51,62.38) v1(40.85,6.94) v1(40.77,0.91) v1(40.87,9.28) v1(42.12,9.89) v1(42.14,6.37) v1(42.23,68.98) v1(43.39,9.36) v1(43.39,6.94) v1(43.43,0.91) v1(43.9,8.09) v1(44.89,68.98) v1(46.1,0.91) v1(47.56,68.98) v1(48.51,57.78) v1(48.51,55.23) v1(48.51,52.69) v1(48.51,50.16) v1(49.02,19.3) v1(49.02,17.04) v1(49.02,14.37) v1(49.02,11.71) v1(49.02,9.04) v1(49.02,6.37) v1(49.02,3.71) v1(49.15,66.32) v1(49.15,63.65) v1(49.15,60.98)
BTN_FUN_0: length 9.6
  Top Layer w0.254: R61.1 R54.1 43.59,44.82 C32.2 D58.2 45.66,44.92 45.97,44.6 45.97,42.82 47.5,41.3 J2.10
BTN_FUN_1: length 9.1
  Top Layer w0.254: R62.1 R55.1 43.59,41.77 C33.2 43.81,41.74 D59.2 45.87,41.74 46.23,41.38 46.23,40.54 47.5,39.27 47.5,38.72
BTN_FUN_2: length 8.7
  Top Layer w0.254: J2.12 46.23,37.45 46.23,38.38 45.78,38.82 D60.2 C34.2 43.59,38.72 R56.1 R63.1
BTN_FUN_3: length 8.2
  Top Layer w0.254: 45.21,35.77 45.78,35.77 46.23,35.33 46.23,34.92 47.5,33.64 ; D61.2 C35.2 42.12,35.77 R57.1 R64.1
BTN_FUN_4: length 7.7
  Top Layer w0.254: J2.14 45.88,32.72 D62.2 C36.2 42.12,32.72 R58.1 R65.1
BTN_FUN_5: length 8.4
  Top Layer w0.254: R66.1 R59.1 43.66,30.59 C37.2 44.7,30.57 D63.2 46.23,30.06 46.23,29.74 47.4,28.56 J2.15
BTN_POWER: length 7.3
  Top Layer w0.254: J2.16 47.47,26 D64.2 44.58,25.36 C38.2 43.66,25.39 40.51,25.39
CAN_ACTIVE: length 47.7
  Top Layer w0.254: RJ1.10 15.07,12 13.75,13.33 7.91,13.33 6.86,14.37 6.86,31.39 11.43,35.96 11.43,46.09 12.95,47.61 14.04,47.61
CAN_MUTE: length 43.6
  Top Layer w0.254: R45.2 37.57,29.67 U5.8 ; 38.01,29.07 35.21,29.07 34.29,30 v1(29.46,30) ; v1(15.11,33.39) 15.11,33.42 12.06,36.47 12.06,45.33 13.08,46.34 14.04,46.34
  Bottom Layer w0.254: v1(15.11,33.39) 18.76,29.74 22.86,29.74 24.38,31.27 27.94,31.27 29.21,30 v1(29.46,30)
CAN_RX: length 26
  Top Layer w0.254: U3.32 22.61,43.99 22.61,42.77 23.47,41.9 24,41.9 24.38,41.52 24.38,30.72 27.05,28.06 27.05,26.15 27.94,25.26 32.68,25.26 32.71,25.29
CAN_TX: length 22.4
  Top Layer w0.254: 32.71,29.1 32.68,29.07 27.18,29.07 25.02,31.23 25.02,41.48 24.09,42.41 23.66,42.41 23.11,42.96 23.11,43.98 U3.33
GPIO_PA0_T21: length 42.2
  Top Layer w0.254: v1(41.53,60.31) 41.53,52.79 45.44,48.89 J2.7 ; v1(19.18,60.31) 19.18,58.06 17.78,56.67 R10.1
  Bottom Layer w0.254: v1(19.18,60.31) v1(41.53,60.31)
GPIO_PA1_T22: length 49
  Top Layer w0.254: v1(40.51,57.68) 40.64,57.55 40.64,48.92 41.53,48.03 45.59,48.03 45.97,47.65 48.39,47.65 48.9,47.14 48.9,45.2 J2.9 ; R11.1 16.51,56.54 18.29,58.32 v1(18.29,59.68)
  Bottom Layer w0.254: v1(40.51,57.68) 38.51,59.68 v1(18.29,59.68)
GPIO_PA2_T23: length 34.7
  Top Layer w0.254: R12.1 14.88,56.18 14.6,55.9 14.6,55.27 14.35,55.01 v1(13.59,55.01) ; D13.2 4.35,41.27 J1.10 1.14,42.63 1.14,57.14 1.8,57.8 5.69,57.8 v1(5.72,57.78)
  Bottom Layer w0.254: v1(13.59,55.01) 12.48,56.12 7.37,56.12 v1(5.72,57.78)
GPIO_PA3_T24: length 46.3
  Top Layer w0.254: v1(13.34,53.97) 14.04,53.97 ; v1(4.83,62.86) 1.78,62.86 0.64,61.71 0.64,40.59 J1.11 4.35,38.73 D12.2
  Bottom Layer w0.254: v1(4.83,62.86) 4.83,57.55 7.14,55.23 12.06,55.23 v1(13.34,53.97)
GPIO_PA4_D_CS: length 19.8
  Top Layer w0.254: D14.2 4.35,61.59 J1.2 ; 14.04,52.69 v1(13.34,52.69)
  Bottom Layer w0.254: v1(13.34,52.69) 11.68,54.35 7.02,54.35 4.06,57.3 4.06,60.82 3.3,61.59 J1.2
GPIO_PA5_D_SCK: length 16.1
  Top Layer w0.254: v1(13.34,51.43) 13.34,51.42 14.04,51.42 ; J1.4 2.59,56.6 D17.2
  Bottom Layer w0.254: v1(13.34,51.43) 13.18,51.43 11.24,53.36 5.46,53.36 2.5,56.32 J1.4
GPIO_PA6_D_DC: length 23.2
  Top Layer w0.254: D15.2 3.05,58.5 J1.3 ; v1(13.34,50.16) 14.04,50.16
  Bottom Layer w0.254: v1(13.34,50.16) 10.79,52.69 1.78,52.69 1.02,53.46 1.02,57.57 J1.3
GPIO_PA7_D_MOSI: length 14.6
  Top Layer w0.254: D16.2 2.85,51.08 J1.6 ; v1(13.34,48.89) 14.04,48.89
  Bottom Layer w0.254: v1(13.34,48.89) 12.95,48.89 10.41,51.42 7.75,51.42 7.74,51.43 J1.6
GPIO_PA8_T11: length 47.1
  Top Layer w0.254: v1(36.19,38.22) v1(36.19,55.11) ; 45.48,56.28 45.55,56.22 47.21,56.22 47.5,56.5 ; R18.1 v1(21.21,39.61)
  Bottom Layer w0.254: 47.5,56.51 46.13,55.14 36.23,55.14 v1(36.19,55.11) ; v1(36.19,38.22) 22.61,38.22 v1(21.21,39.61)
GPIO_PA9_T12: length 42.9
  Top Layer w0.254: J2.5 47.15,54.32 45.55,54.32 D22.1 ; v1(35.31,38.85) 35.38,38.93 35.38,53.53 v1(35.43,53.58) ; R20.1 v1(22.48,39.61)
  Bottom Layer w0.254: 47.5,53.97 47.15,53.62 35.47,53.62 v1(35.43,53.58) ; v1(35.31,38.85) 23.24,38.85 v1(22.48,39.61)
GPIO_PA10_T13: length 37.2
  Top Layer w0.254: 47.5,51.42 46.59,51.42 45.42,52.6 ; v1(34.56,41.87) 34.72,42.03 34.72,51.42 ; R21.1 v1(23.75,39.61)
  Bottom Layer w0.254: v1(34.56,41.87) 31.59,41.87 29.34,39.61 v1(23.75,39.61) ; 47.5,51.43 37.59,51.43 37.58,51.42 v1(34.8,51.42)
GPIO_PA15_F1: length 55.4
  Top Layer w0.254: 31.88,41.52 31.87,41.51 31.87,34.85 v1(31.88,34.84) ; 31.88,41.52 R22.1 ; 31.88,41.52 v1(31.88,44.95) ; D24.1 4.81,30.25 3.36,30.25 J1.14
  Bottom Layer w0.254: v1(31.88,34.84) 31.73,34.69 9.27,34.69 5.69,31.11 J1.14 ; v1(31.88,44.95) 32.9,44.95 32.93,44.98 36.96,44.98 38.96,42.98 41.06,42.98
GPIO_PB2_F2: length 58.2
  Top Layer w0.254: v1(7.87,45.08) 7.87,36.34 5.72,34.19 5.72,28.58 D25.1 3.38,27.69 J1.15 ; 2.82,28.57 2.67,28.57 ; v1(13.34,45.08) 14.04,45.08
  Bottom Layer w0.254: v1(7.87,45.08) v1(13.34,45.08) 14.73,45.08 15.88,43.93 27.43,43.93 27.94,43.42 37.24,43.42 38,42.66 38,41.39 39.12,40.28 40.59,40.28 40.97,40.66
GPIO_PB4_F3: length 61
  Top Layer w0.254: v1(32.89,44.19) v1(32.89,39.61) v1(32.89,37.45) ; D26.1 4.68,25.55 3.94,25.55 3.46,26.03 J1.16 ; v1(30.99,44.06) R27.1
  Bottom Layer w0.254: v1(30.99,44.06) 31.12,44.19 v1(32.89,44.19) ; J1.16 1.14,27.39 1.14,31.87 1.65,32.38 3.94,32.38 9.02,37.45 v1(32.89,37.45) ; R50.2 37.37,38.6 36.35,39.61 v1(32.89,39.61)
GPIO_PB5_FP: length 66.6
  Top Layer w0.254: v1(4.57,19.07) 4.57,18.45 D27.1 2.53,18.44 J1.19 ; v1(33.78,34.15) 33.78,45.46 33.4,45.84 31.24,45.84 30.73,45.33 R29.1
  Bottom Layer w0.254: v1(4.57,19.07) 5.46,19.07 6.86,20.47 6.86,28.98 11.94,34.06 33.69,34.06 v1(33.78,34.15) 34.7,33.23 36.77,33.23 37.88,32.12 41.19,32.12
GPIO_PB10_F4: length 73.6
  Top Layer w0.254: J1.17 2.82,23.49 3.44,22.87 D28.1 ; v1(13.08,36.82) 13.08,41.39 12.7,41.77 12.7,43.68 v1(12.83,43.81) 14.04,43.81
  Bottom Layer w0.254: v1(13.08,36.82) 13.11,36.85 33.27,36.85 33.69,36.44 R51.2 ; J1.17 0.64,25.36 0.64,43.93 1.78,45.08 3.05,45.08 4.32,43.81 v1(12.83,43.81)
GPIO_PB11_F5: length 63.4
  Top Layer w0.254: J1.18 3.15,20.95 3.56,21.36 D29.1 6.35,23.15 6.35,32.66 9.14,35.46 v1(9.14,39.01) ; v1(13.34,42.53) 14.04,42.53 14.22,42.36 v1(14.22,36.19)
  Bottom Layer w0.254: v1(14.22,36.19) 14.26,36.22 32.55,36.22 33.98,34.79 41.07,34.79 ; v1(13.34,42.53) 10.25,42.53 9.14,41.42 v1(9.14,39.01)
GPIO_PB12_D_BUSY: length 25.7
  Top Layer w0.254: v1(10.41,40.25) 9.81,40.25 9.35,40.71 9.35,47.72 v1(9.32,47.75) ; D30.1 2.53,48.92 J1.7 ; v1(17.4,39.49) R38.1
  Bottom Layer w0.254: v1(9.32,47.75) 3.64,47.75 J1.7 ; v1(17.4,39.49) 16.64,40.25 v1(10.41,40.25)
GPIO_PB13_D_PWR: length 25.5
  Top Layer w0.254: v1(8.64,45.97) 8.64,40.38 v1(9.91,39.11) ; v1(18.67,39.61) R39.1 ; J1.8 2.53,46.38 D32.1
  Bottom Layer w0.254: v1(9.91,39.11) 10.16,38.85 17.91,38.85 v1(18.67,39.61) ; v1(8.64,45.97) 8.61,46 2.85,46 J1.8
GPIO_PB14_D_RST: length 23.2
  Top Layer w0.254: v1(19.94,39.36) R40.1 ; 4.43,43.58 2.73,43.58 J1.9
  Bottom Layer w0.254: v1(19.94,39.36) 18.92,38.34 7.62,38.34 2.5,43.46 J1.9
GPIO_PC13_F0: length 72.7
  Top Layer w0.254: R41.1 28.19,59.05 27.43,59.81 23.11,59.81 22.1,58.79 v1(22.1,57.9) ; v1(9.27,57.68) 9.27,49.05 7.11,46.89 7.11,38.72 4.58,36.19 J1.12
  Bottom Layer w0.254: R47.2 41.02,45.12 41.02,48.03 39.13,49.92 33.41,49.92 25.48,57.85 18.84,57.85 18.67,57.68 v1(9.27,57.68)
HOST_POWER: length 21.8
  Top Layer w0.254: R8.1 23.88,28.82 v1(23.88,29.49) ; v1(18.8,29.11) 18.8,33.17 20.59,34.97 U3.28
  Bottom Layer w0.254: v1(18.8,29.11) 18.83,29.08 23.46,29.08 v1(23.88,29.49)
I2C_SCL: length 54.7
  Top Layer w0.254: 45.53,60.98 45.59,61.05 45.59,62.22 J2.1 ; 13.73,60.98 14.86,60.98 v1(15.62,61.75) ; R34.2 31.7,50.41 31.62,50.48 31.62,50.79 31.88,51.04 33.02,51.04 33.27,51.3 33.27,52.19 32,53.46 U4.6 32,56.25 29.46,58.79 29.46,60.32 ; 29.46,60.32 v1(29.46,61.71) ; 29.46,60.32 TP14.1
  Bottom Layer w0.254: 47.5,64.13 45.08,61.71 v1(29.46,61.71) 29.43,61.75 v1(15.62,61.75)
I2C_SDA: length 48.9
  Top Layer w0.254: v1(15.62,60.47) 14.86,59.71 U6.1 ; v1(21.34,60.98) 27.24,60.98 28.88,59.35 28.88,58.2 v1(29.88,57.2) ; J2.3 47.47,59.02 45.09,59.02 ; 31.7,51.68 R35.2 30.35,51.75 30.35,52.69 30.73,53.08 U4.5 30.73,56.34 v1(29.88,57.2) ; v1(29.88,57.2) 29.88,56.8 TP13.1
  Bottom Layer w0.254: v1(15.62,60.47) 16.13,60.98 v1(21.34,60.98) ; J2.3 45.25,56.79 38.61,56.79 38.18,57.22 29.89,57.22 v1(29.88,57.2)
RESET: length 31.8
  Top Layer w0.254: v1(24.76,62.47) 20.07,62.47 ; 20.07,62.47 R70.1 ; 20.07,62.47 v1(16.76,62.47) 16.64,62.47 15.24,63.87 15.24,64.62 14.48,65.39 ; 14.35,65.39 14.28,65.46 12.57,65.46 ; CN7.12 27.57,63.32 D7.2 v1(26.67,63.27)
  Bottom Layer w0.254: 8.37,63.49 8.47,63.58 14.87,63.58 15.97,62.47 16.77,62.47 SW1.1 ; v1(24.76,62.47) 25.88,62.47 v1(26.67,63.27)
STL_COM_RX: length 36.7
  Top Layer w0.254: v1(39.88,47.78) 39.75,47.9 39.75,60.86 33.91,66.7 30.99,66.7 30.29,66 D3.2 29.02,65.81 CN7.13 ; R33.2 30.31,47.9 v1(30.99,47.9)
  Bottom Layer w0.254: v1(39.88,47.78) 31.12,47.78 v1(30.99,47.9)
STL_COM_TX: length 33.5
  Top Layer w0.254: CN7.14 30.11,64.72 D8.2 30.29,64.35 31.12,63.52 35.69,63.52 38.8,60.41 38.8,55.97 37.59,54.76 v1(37.59,46.6) ; R31.2 30.31,46.63 v1(30.99,46.63)
  Bottom Layer w0.254: v1(30.99,46.63) 31.02,46.6 v1(37.59,46.6)
SWCLK: length 64.3
  Top Layer w0.254: R30.1 30.28,39.67 30.1,39.49 28.07,39.49 v1(27.24,40.31) ; v1(10.77,41.65) 10.77,62.61 11.3,63.14 11.3,67.84 11.94,68.48 14.35,68.48 15.11,67.71 15.11,66.63 D5.2 16,65.74 16,64.89 17.75,63.14 22.35,63.14 23.76,64.55 CN7.6
  Bottom Layer w0.254: v1(27.24,40.31) 25.91,41.65 v1(10.77,41.65)
SWDIO: length 62.8
  Top Layer w0.254: v1(10.03,41.01) 10.03,63.14 10.67,63.78 10.67,68.22 11.56,69.11 17.27,69.11 17.91,68.48 17.91,66.76 D4.2 17.15,65.74 17.15,65.17 18.54,63.78 21.84,63.78 22.49,64.42 CN7.4 ; v1(26.29,40.25) 25.71,40.25 R32.1
  Bottom Layer w0.254: v1(26.29,40.25) 25.53,41.01 v1(10.03,41.01)
TRACESWO: length 41.9
  Top Layer w0.254: v1(36.96,42.79) 36.96,55.14 37.85,56.03 37.85,59.97 35.31,62.51 26.16,62.51 25.46,63.28 25.03,63.7 CN7.8 ; v1(28.57,42.15) 30.02,42.15 30.28,42.41 R28.1 30.34,42.73 v1(30.92,42.73)
  Bottom Layer w0.254: v1(36.96,42.79) 36.89,42.73 v1(30.92,42.73)
VAUX+: length 0.8
  Bottom Layer w1.016: 11.65,6.78 11.65,7.12 RJ1.4 ; 12.67,5.76 12.67,5.37 RJ1.5
$1N4416: length 4.6
  Top Layer w0.254: C10.2 21.46,54.92 21.46,54.35 v1(21.97,53.84) 22.09,53.72 U3.6
  Bottom Layer w0.254: X2.1 21.84,53.97 v1(21.97,53.84)
$1N4417: length 4.6
  Top Layer w0.254: U3.5 22.61,52.51 22.61,53.84 v1(22.86,54.09) 22.99,54.22 C9.2
  Bottom Layer w0.254: 24.53,53.97 24.4,54.09 v1(22.86,54.09)
$1N4420: length 32.8
  Top Layer w0.254: v1(6.22,63.02) 5.72,63.52 D65.3 ; v1(24,50.06) 24,50.44 24.59,51.03 U3.1 ; v1(13.97,55.9) 13.97,56.35 C39.1
  Bottom Layer w0.254: v1(6.22,63.02) 6.22,58.32 7.75,56.79 13.08,56.79 v1(13.97,55.9) 17.65,52.22 22.73,52.22 24,50.95 v1(24,50.06)
$1N4427: length 6.2
  Top Layer w0.254: R70.2 20.32,57.85 20.32,54.63 21.59,53.35 U3.7
$1N4428: length 3.4
  Top Layer w0.254: U3.44 28.44,49 28.57,49.14 R71.2
$1N4429: length 6.3
  Top Layer w0.254: U3.39 27.15,46.5 27.69,45.96 27.69,43.55 28.45,42.79 R28.2
$1N4431: length 7.3
  Top Layer w0.254: U3.37 26.67,44.92 26.67,41.9 28.32,40.25 R30.2
$1N4433: length 4
  Top Layer w0.254: U3.34 23.59,43.17 23.85,42.92 24.21,42.92 25.65,41.47 R32.2
$1N4455: length 3.6
  Top Layer w0.254: U3.15 17.57,50.03 16,50.03 15.75,50.28 15.75,50.92 15.24,51.42 R15.1
$1N4457: length 2.7
  Top Layer w0.254: U3.17 15.03,49 R17.1
$1N4459: length 3.9
  Top Layer w0.254: R14.1 14.99,52.69 16.38,51.3 16.38,50.75 16.64,50.5 U3.14
$1N4465: length 3
  Top Layer w0.254: U3.16 17.57,49.52 15.55,49.52 R16.1
$1N4470: length 7.7
  Top Layer w0.254: C7.2 26.67,56.76 27.16,56.27 X1.2 27.16,54.83 26.42,54.09 24.38,54.09 23.62,53.33 23.62,52.53 U3.3
$1N4471: length 5.6
  Top Layer w0.254: U3.4 23.09,53.45 24.66,55.02 X1.1 24.89,55.6 C8.2
$1N5665: length 12
  Top Layer w0.66: U1.3 U1.2
  Top Layer w0.711: U1.2 17.48,25.75 C5.2
  Top Layer w0.965: C5.2 C4.2
  Top Layer w1: L1.2 18.1,19.22 19.1,20.22 19.1,22.47 18.12,23.45 C4.2
$1N5782: length 1.5
  Top Layer w0.66: U1.4 15.35,29.81 R5.2
$1N5823: length 4.8
  Top Layer w0.254: C31.2 9.95,24.44 U1.8
  Top Layer w0.61: L2.1 9.99,21.92 v1(9.99,23.61) U1.8
$1N5835: length 2
  Top Layer w0.254: U1.7 9.9,25.84 C31.1
$1N5847: length 5.5
  Top Layer w0.559: R7.2 9.25,29.94 R2.1
  Top Layer w0.61: C2.1 10.83,29.99 R2.1
  Top Layer w0.66: R2.1 10.77,29.07 U1.5
$1N6632: length 18.3
  Top Layer w0.254: v1(31.75,31.65) U2.2 31.12,31.99 R74.1
  Top Layer w0.61: R6.2 U2.2
  Bottom Layer w0.4: 35.06,25.13 35.4,25.13 36.32,26.06 36.32,27.2 37.21,28.09 37.21,31.65 36.34,32.51 33.12,32.51 32.26,31.65 v1(31.75,31.65)
$1N7577: length 1.8
  Top Layer w0.711: R3.1 C6.2
$1N11074: length 3.6
  Top Layer w0.254: R33.1 29.08,47.87 28.45,48.5 U3.43
$1N11077: length 4
  Top Layer w0.254: R31.1 29.41,46.78 28.19,48 U3.42
$1N11096: length 3.7
  Top Layer w0.254: U3.45 27.94,49.5 28.85,50.41 R34.1
$1N11100: length 4
  Top Layer w0.254: R35.1 29.08,51.68 27.4,50 U3.46
$1N11390: length 3.1
  Top Layer w0.254: Q3.1 24,25.98 R8.2 24,27.18 R9.2
$1N11444: length 6.8
  Bottom Layer w1.4: 23.5,25.23 24.19,24.53
  Bottom Layer w1.625: 29.08,22.21 26.76,24.53 24.19,24.53
$1N11903: length 1.6
  Top Layer w0.254: R4.1 23.88,23.15 Q3.3
$1N12475: length 7.2
  Top Layer w0.254: U3.38 26.92,46 27.2,45.73 27.2,42.26 27.94,41.52 R22.2
$1N12477: length 3
  Top Layer w0.254: R24.2 15.24,47.61 16.12,48.5 U3.18
$1N12479: length 3.5
  Top Layer w0.254: R25.2 14.91,46.6 16.3,48 17.59,48 U3.19
$1N12481: length 4.5
  Top Layer w0.254: 14.78,45.08 15.34,45.08 15.59,45.33 15.59,46.58 16.51,47.5 U3.20
$1N12483: length 5.6
  Top Layer w0.254: U3.40 27.41,47 28.19,46.22 28.19,44.44 28.57,44.06 R27.2
$1N12485: length 4.7
  Top Layer w0.254: R29.2 29.34,45.33 28.7,45.96 28.7,46.73 27.93,47.5 U3.41
$1N12491: length 5.2
  Top Layer w0.254: R36.2 15.49,43.81 16.04,44.35 16.04,46.41 16.61,46.98 17.57,46.98 U3.21
$1N12495: length 5.8
  Top Layer w0.254: U3.22 16.79,46.5 16.54,46.25 16.54,43.81 15.27,42.53 R37.2
$1N12497: length 3.6
  Top Layer w0.254: R38.2 19.09,42.76 U3.25
$1N12499: length 3.3
  Top Layer w0.254: R39.2 19.59,41.99 U3.26
$1N12501: length 3
  Top Layer w0.254: U3.27 20.09,41.22 R40.2
$1N12505: length 8.5
  Top Layer w0.254: U3.2 24.13,52.54 24.13,53.33 24.45,53.65 27.37,53.65 28.07,54.35 28.07,57.47 R41.2
$1N14397: length 10.6
  Top Layer w0.254: U5.7 37.08,27.83 34.88,25.63 ; L3.1 36.46,24.05 34.88,25.63 ; C20.1 32.7,23.64 33.72,24.66 33.91,24.66 34.88,25.63
$1N14402: length 12.6
  Top Layer w0.254: U5.6 36.96,26.56 36.45,26.05 36.45,25.04 36.83,24.66 37.19,24.66 37.59,24.26 37.59,23.01 37.21,22.63 35.38,22.63 L3.2 32.46,21.74 C19.1
$1N14446: length 2.6
  Top Layer w0.254: R68.1 10.94,10.69 C30.2
$1N14515: length 18.2
  Top Layer w0.254: R68.2 13.9,7.35 RJ1.6
  Inner1 w0.254: RJ1.3 9.09,3.83 8.25,3.83 7.11,4.98 7.11,7.77 8.51,9.17 12.06,9.17 13.67,7.55 RJ1.6
$1N14552: length 43.5
  Top Layer w0.254: D9.1 7.36,6.57 RJ1.1 ; 8.64,5.29 8.64,3.2 9.27,2.56 14.86,2.56 21.84,9.55 21.84,15.52 22.86,16.53 30.35,16.53 33.53,19.71 35.33,19.71 L3.4
$1N14560: length 46.7
  Top Layer w0.254: D9.2 8.26,8.47 RJ1.2 ; L3.3 33.9,20.84 30.16,17.1 22.42,17.1 21.21,15.9 21.21,9.93 14.6,3.32 v1(9.91,3.32)
  Bottom Layer w0.254: RJ1.2 9.34,7.39 7.62,7.39 7.11,6.88 7.11,4.98 8.76,3.32 v1(9.91,3.32)
$1N14808: length 11.1
  Top Layer w0.254: C23.2 40.49,46.28 R61.2 41.47,47.27 45.34,47.27 46.04,46.57 v1(46.04,45.49)
  Bottom Layer w0.254: v1(46.04,45.49) 44.44,45.49 R47.1
$1N14984: length 8.5
  Top Layer w0.2: 41.32,44.09 v1(45.21,44.09)
  Top Layer w0.254: 41.32,44.09 R62.2 40.46,43.23 C24.2
  Bottom Layer w0.254: R48.1 44.02,43.16 44.7,43.84 44.96,43.84 v1(45.21,44.09)
$1N15029: length 7.4
  Top Layer w0.2: 41.27,41 v1(44.92,41)
  Top Layer w0.254: C25.2 40.46,40.19 R63.2 41.27,41
  Bottom Layer w0.254: v1(44.92,41) 44.68,40.76 R49.1
$1N15074: length 7.7
  Top Layer w0.2: 44.92,38.01 44.9,37.98 41.36,37.98
  Top Layer w0.254: 41.36,37.98 41.15,37.98 40.52,37.36 R64.2 40.46,37.14 C26.2 ; 44.92,38.01 v1(44.93,38.02)
  Bottom Layer w0.254: v1(44.93,38.02) 44.6,38.02 R50.1
$1N15119: length 8.9
  Top Layer w0.254: v1(45.34,34.95) 41.32,34.95 R65.2 40.46,34.09 C27.2
  Bottom Layer w0.254: v1(45.34,34.95) 44.02,36.26 R51.1
$1N15164: length 16.5
  Top Layer w0.254: R66.2 40.53,27.49 C28.2 40.77,27.26 40.77,26.69 40.95,26.51 44.65,26.51 45.09,26.95 v1(46.23,26.95)
  Bottom Layer w0.254: R52.1 44.02,34.23 46.1,32.15 46.1,27.07 v1(46.23,26.95)
$1N15209: length 16.9
  Top Layer w0.254: C29.2 40.51,22.28 40.51,23.05 ; 40.51,23.05 45.76,23.05 v1(45.85,23.14) ; 40.51,23.05 R67.2
  Bottom Layer w0.254: v1(45.85,23.14) 45.85,23.52 45.97,23.64 45.97,26.31 45.59,26.69 45.59,30.55 R53.1
$1N19303: length 3.3
  Top Layer w0.254: RJ1.11 7.57,12.36 6.07,13.87 5.47,13.87 R46.1
$1N19384: length 2.1
  Top Layer w0.254: R69.1 18.99,10.44 RJ1.9
$1N19621: length 4.2
  Top Layer w0.254: R13.2 15.13,53.97 17.59,51.51 U3.13
$1N19661: length 5.3
  Top Layer w0.254: R12.2 15.24,54.89 17.63,52.5 U3.12
$1N19701: length 4.4
  Top Layer w0.254: U3.10 20.09,53.43 19.3,54.22 18.29,54.22 17.78,54.73 R10.2
$1N19741: length 5
  Top Layer w0.254: U3.11 19.59,53.25 19.26,53.58 17.69,53.58 16.51,54.76 R11.2
$1N19781: length 3
  Top Layer w0.254: R18.2 21.09,41.18 U3.29
$1N19821: length 3.3
  Top Layer w0.254: R20.2 21.59,41.95 U3.30
$1N19861: length 3.6
  Top Layer w0.254: 23.62,41.06 23.57,41.06 22.1,42.53 22.1,44 U3.31
$1N69046: length 3.1
  Top Layer w0.254: D65.2 4.83,67.87 v1(4.83,66.7)
  Bottom Layer w0.254: v1(4.83,66.7) 5.69,65.83 CN6.2
$1N87863: length 16.3
  Top Layer w0.254: 23.87,20.96 25.25,20.96 26.29,21.99 v1(26.29,27.3) ; 23.87,20.96 R1.1 ; 23.87,20.96 23.87,20.09 24.77,19.2 24.77,18.83 24.81,18.79 ; ZD1.2 25.12,19.17 25.53,19.58 26.35,19.58 C42.1
  Bottom Layer w0.254: v1(26.29,27.3) 26.29,28.6 26.79,29.1

## Copper pours and planes (outline as drawn; the poured copper is in the pictures)
+12V on Bottom Layer: 30.1,30.61 30.11,30.71 30.16,30.84 30.25,30.96 30.36,31.04 30.49,31.09 30.6,31.11 36.58,31.11 36.69,31.09 36.82,31.04 36.94,30.96 37.02,30.84 37.07,30.71 37.08,30.61 37.08,27.67 37.07,27.56 37.02,27.43 36.94,27.31 36.82,27.23 36.69,27.18 36.58,27.17 30.6,27.17 30.49,27.18 30.36,27.23 30.25,27.31 30.16,27.43 30.11,27.56 30.1,27.67
GND on Top Layer: 51.69,-1.37 -1.14,-1.37 -1.14,71.02 51.69,71.02
GND on Bottom Layer: -0.38,71.65 52.58,71.65 52.58,-0.74 -0.38,-0.74
GND on Inner1: -1.14,82.16 52.07,82.16 52.07,-3.19 -1.14,-3.19
GND on Inner2: -2.03,81.91 51.56,81.91 51.56,-3.44 -2.03,-3.44
VAUX+ on Bottom Layer: 10.29,9.82 10.3,9.99 10.36,10.19 10.45,10.37 10.58,10.53 10.74,10.65 10.92,10.75 11.11,10.8 11.29,10.82 25.03,10.82 25.21,10.8 25.41,10.75 25.59,10.65 25.74,10.53 25.87,10.37 25.96,10.19 26.02,9.99 26.03,9.82 26.03,3.82 26.02,3.64 25.96,3.45 25.87,3.27 25.74,3.11 25.59,2.98 25.41,2.89 25.21,2.83 25.03,2.82 11.29,2.82 11.11,2.83 10.92,2.89 10.74,2.98 10.58,3.11 10.45,3.27 10.36,3.45 10.3,3.64 10.29,3.82
VAUX- on Inner1: 13.73,9.9 13.75,10.08 13.8,10.27 13.9,10.45 14.03,10.61 14.18,10.74 14.36,10.83 14.56,10.89 14.73,10.9 30.75,10.9 30.93,10.89 31.12,10.83 31.3,10.74 31.46,10.61 31.58,10.45 31.68,10.27 31.73,10.08 31.75,9.9 31.75,5.09 31.73,4.91 31.68,4.72 31.58,4.54 31.46,4.38 31.3,4.25 31.12,4.16 30.93,4.1 30.75,4.09 14.73,4.09 14.56,4.1 14.36,4.16 14.18,4.25 14.03,4.38 13.9,4.54 13.8,4.72 13.75,4.91 13.73,5.09
VAUX- on Inner2: 13.73,9.9 13.75,10.08 13.8,10.27 13.9,10.45 14.03,10.61 14.18,10.74 14.36,10.83 14.56,10.89 14.73,10.9 30.75,10.9 30.93,10.89 31.12,10.83 31.3,10.74 31.46,10.61 31.58,10.45 31.68,10.27 31.73,10.08 31.75,9.9 31.75,5.09 31.73,4.91 31.68,4.72 31.58,4.54 31.46,4.38 31.3,4.25 31.12,4.16 30.93,4.1 30.75,4.09 14.73,4.09 14.56,4.1 14.36,4.16 14.18,4.25 14.03,4.38 13.9,4.54 13.8,4.72 13.75,4.91 13.73,5.09
$1N8206 on Bottom Layer: 34.93,15.87 34.94,15.98 34.99,16.11 35.07,16.23 35.19,16.31 35.32,16.36 35.43,16.37 38.87,16.37 38.98,16.36 39.11,16.31 39.22,16.23 39.31,16.11 39.36,15.98 39.37,15.87 39.37,6.46 39.36,6.35 39.31,6.22 39.22,6.11 39.11,6.02 38.98,5.97 38.87,5.96 35.43,5.96 35.32,5.97 35.19,6.02 35.07,6.11 34.99,6.22 34.94,6.35 34.93,6.46
$1N8211 on Bottom Layer: 39.83,24.64 39.84,24.74 39.89,24.88 39.97,24.99 40.09,25.07 40.22,25.12 40.33,25.14 44.08,25.14 44.18,25.12 44.32,25.07 44.43,24.99 44.52,24.88 44.57,24.74 44.58,24.64 44.58,12.97 44.57,12.86 44.52,12.73 44.43,12.61 44.32,12.53 44.18,12.48 44.08,12.47 40.33,12.47 40.22,12.48 40.09,12.53 39.97,12.61 39.89,12.73 39.84,12.86 39.83,12.97
$1N11444 on Bottom Layer: 27.31,19.94 27.32,20.04 27.37,20.18 27.45,20.29 27.57,20.38 27.7,20.43 27.81,20.44 30.87,20.44 30.98,20.43 31.11,20.38 31.22,20.29 31.31,20.18 31.36,20.04 31.37,19.94 31.37,13.32 31.36,13.21 31.31,13.08 31.22,12.96 31.11,12.88 30.98,12.83 30.87,12.82 27.81,12.82 27.7,12.83 27.57,12.88 27.45,12.96 27.37,13.08 27.32,13.21 27.31,13.32

Small or netless copper shapes (teardrops, artwork), in the pictures only: 640 on Top Layer, 155 on Bottom Layer, 32 on Inner1

## Text on the board
Bottom Silkscreen Layer: . | PB2 | PB5 | PA6 | GND | PB4 | PA5 | PA7 | PA2 | PA3 | PA4 | PB11 | PB12 | PB13 | PB10 | PB14 | PC13 | PA15 | PA8 | PA9 | PA10 | SDA | SCL | BF0 | BF1 | BF2 | BF3 | BF4 | BF5 | PWR | PA1 | + | 3V3 | RTC | PA0 | IN | OUT | CAN / PWR | HOST / LOAD | PWR / IN | PWR / SW | SWD | RESET | BTN0 | BTN1 | BTN2 | BTN3 | BTN4 | BTN5 | - | SEMANTIC BOAT PROJECT | CAN-MCU V102
Top Silkscreen Layer: 2A MAX | CAN 12V OUT | BF1 | BF0 | BF4 | BF2 | BF3 | IN | OUT | BF5 | BPW | HOST LOAD | PWR SWITCH | 12V IN | 8A MAX | - | +
